# Altium schematic sheet PCB_RTM_SATA.SchDoc: RTM SATA
size 420 x 297 mm; Author: G.K.; CompanyName: WUT; DrawnBy: G.K.; Organization: CERN; Address1: Warsaw Univeristy of Technology; Address2: Nowowiejska 15/19; Revision: -; SheetNumber: -; SheetTotal: -; EDA_Number: ARTIQ; Projet: SINARA; ModifiedBy: -; CreateDate: XX/XX/XXXX; CheckedDate: -; Title2: adapter; DivGrp: ISE; Designer: G.K.; ModifiedDate: -; ProjectName: SINARA
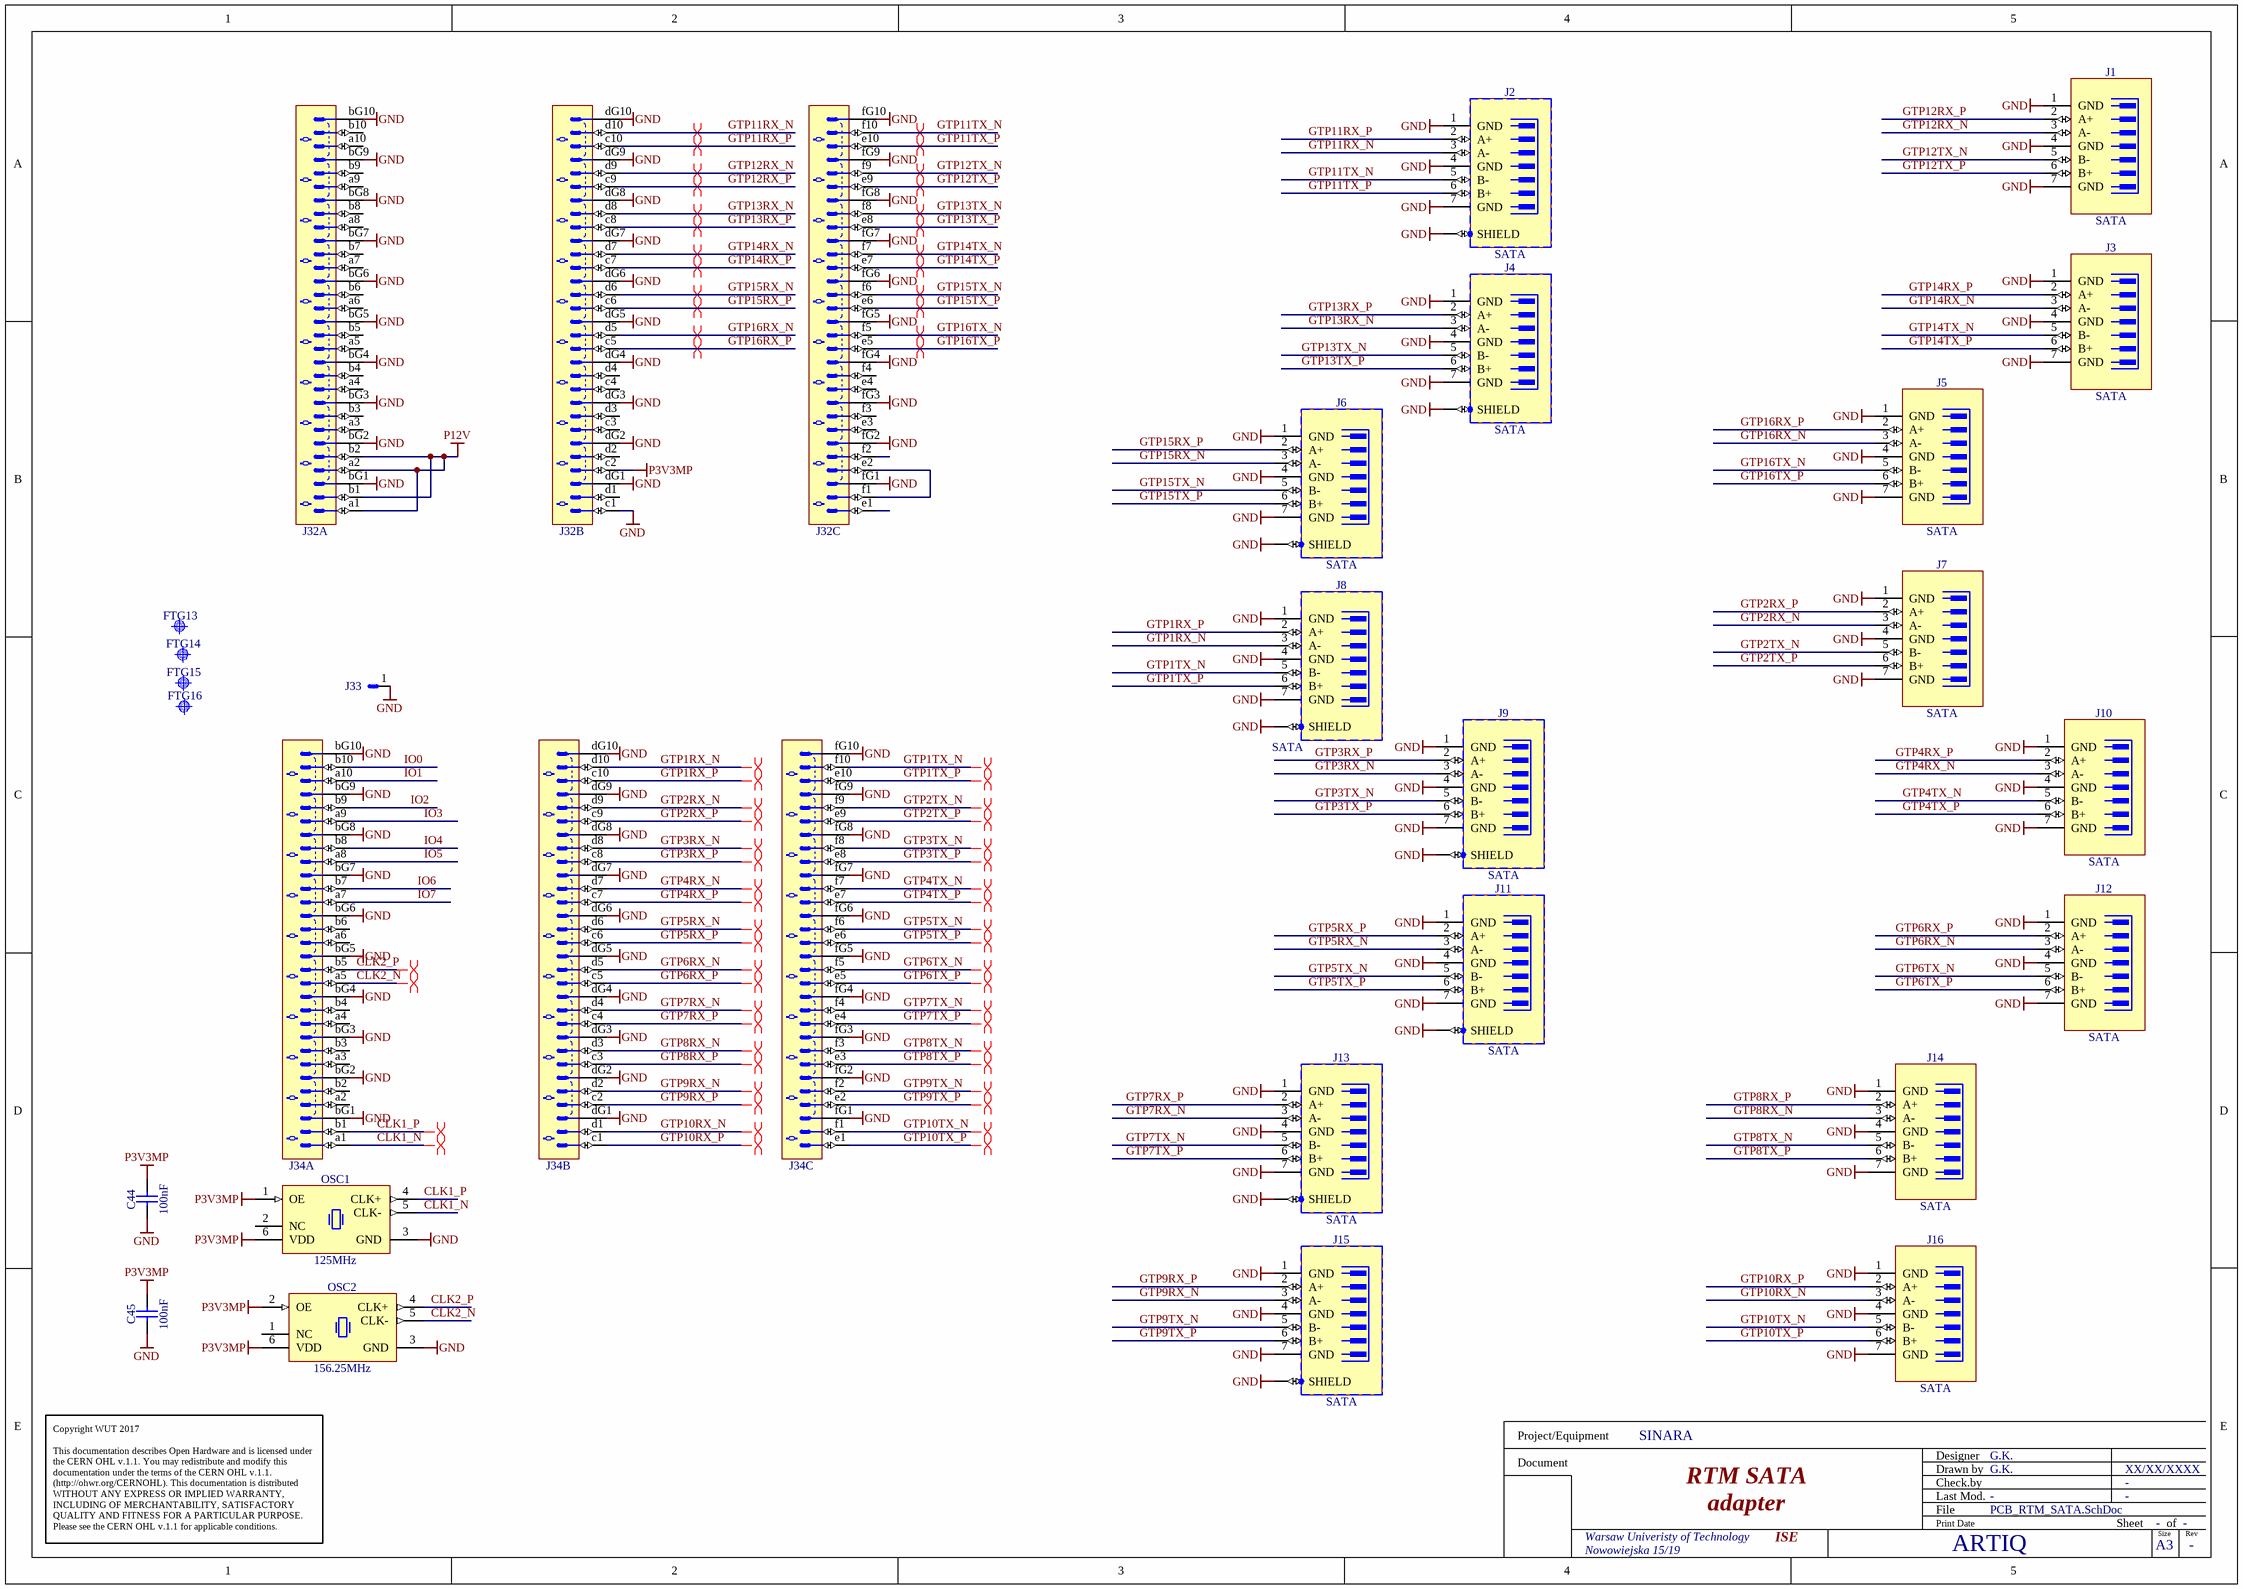
[diagram p0: PCB_RTM_SATA.SchDoc]

## Parts
C44  100nF  [CAPC1005X55N]
C45  100nF  [CAPC1005X55N]
FTG13  Use only in PCB  [FIDUCIAL_TOP_C100-200]  (value not drawn)
FTG14  Use only in PCB  [FIDUCIAL_TOP_S100-200]  (value not drawn)
FTG15  Use only in PCB  [FIDUCIAL_TOP_S200-400]  (value not drawn)
FTG16  Use only in PCB  [FIDUCIAL_TOP_S100-200]  (value not drawn)
J1  SATA  [MOLEX_67800-5005]
J2  SATA  [3M_5607-4200-SH]
J3  SATA  [MOLEX_67800-5005]
J4  SATA  [3M_5607-4200-SH]
J5  SATA  [MOLEX_67800-5005]
J6  SATA  [3M_5607-4200-SH]
J7  SATA  [MOLEX_67800-5005]
J8  SATA  [3M_5607-4200-SH]
J9  SATA  [3M_5607-4200-SH]
J10  SATA  [MOLEX_67800-5005]
J11  SATA  [3M_5607-4200-SH]
J12  SATA  [MOLEX_67800-5005]
J13  SATA  [3M_5607-4200-SH]
J14  SATA  [MOLEX_67800-5005]
J15  SATA  [3M_5607-4200-SH]
J16  SATA  [MOLEX_67800-5005]
J32  (no value)  [TYCO_6469183-1]  (parts A,B,C of 3)
J33  (no value)  [TYCO_1469265-1]
J34  (no value)  [TYCO_6469183-1]  (parts A,B,C of 3)
OSC1  125MHz  [OSC_SILICON-LAB_SI531]
OSC2  156.25MHz  [OSC_SILICON-LAB_SI530]

## Nets
GND: C44.1 C45.1 J1.1(GND) J1.4(GND) J1.7(GND) J2.1(GND) J2.4(GND) J2.7(GND) J2.8(SHIELD) J3.1(GND) J3.4(GND) J3.7(GND) J4.1(GND) J4.4(GND) J4.7(GND) J4.8(SHIELD) J5.1(GND) J5.4(GND) J5.7(GND) J6.1(GND) J6.4(GND) J6.7(GND) J6.8(SHIELD) J7.1(GND) J7.4(GND) J7.7(GND) J8.1(GND) J8.4(GND) J8.7(GND) J8.8(SHIELD) J9.1(GND) J9.4(GND) J9.7(GND) J9.8(SHIELD) J10.1(GND) J10.4(GND) J10.7(GND) J11.1(GND) J11.4(GND) J11.7(GND) J11.8(SHIELD) J12.1(GND) J12.4(GND) J12.7(GND) J13.1(GND) J13.4(GND) J13.7(GND) J13.8(SHIELD) J14.1(GND) J14.4(GND) J14.7(GND) J15.1(GND) J15.4(GND) J15.7(GND) J15.8(SHIELD) J16.1(GND) J16.4(GND) J16.7(GND) J32.bG1 J32.bG2 J32.bG3 J32.bG4 J32.bG5 J32.bG6 J32.bG7 J32.bG8 J32.bG9 J32.bG10 J32.c1 J32.dG1 J32.dG2 J32.dG3 J32.dG4 J32.dG5 J32.dG6 J32.dG7 J32.dG8 J32.dG9 J32.dG10 J32.fG1 J32.fG2 J32.fG3 J32.fG4 J32.fG5 J32.fG6 J32.fG7 J32.fG8 J32.fG9 J32.fG10 J33.1 J34.bG1 J34.bG2 J34.bG3 J34.bG4 J34.bG5 J34.bG6 J34.bG7 J34.bG8 J34.bG9 J34.bG10 J34.dG1 J34.dG2 J34.dG3 J34.dG4 J34.dG5 J34.dG6 J34.dG7 J34.dG8 J34.dG9 J34.dG10 J34.fG1 J34.fG2 J34.fG3 J34.fG4 J34.fG5 J34.fG6 J34.fG7 J34.fG8 J34.fG9 J34.fG10 OSC1.3(GND) OSC2.3(GND)
P3V3MP: C44.2 C45.2 J32.c2 OSC1.1(OE) OSC1.6(VDD) OSC2.2(OE) OSC2.6(VDD)
P12V: J32.a1 J32.a2 J32.b1 J32.b2
CLK1_N: J34.a1 OSC1.5(CLK-)
CLK1_P: J34.b1 OSC1.4(CLK+)
CLK2_N: J34.a5 OSC2.5(CLK-)
CLK2_P: J34.b5 OSC2.4(CLK+)
GTP1RX_N: J8.3(A-) J34.d10
GTP1RX_P: J8.2(A+) J34.c10
GTP1TX_N: J8.5(B-) J34.f10
GTP1TX_P: J8.6(B+) J34.e10
GTP2RX_N: J7.3(A-) J34.d9
GTP2RX_P: J7.2(A+) J34.c9
GTP2TX_N: J7.5(B-) J34.f9
GTP2TX_P: J7.6(B+) J34.e9
GTP3RX_N: J9.3(A-) J34.d8
GTP3RX_P: J9.2(A+) J34.c8
GTP3TX_N: J9.5(B-) J34.f8
GTP3TX_P: J9.6(B+) J34.e8
GTP4RX_N: J10.3(A-) J34.d7
GTP4RX_P: J10.2(A+) J34.c7
GTP4TX_N: J10.5(B-) J34.f7
GTP4TX_P: J10.6(B+) J34.e7
GTP5RX_N: J11.3(A-) J34.d6
GTP5RX_P: J11.2(A+) J34.c6
GTP5TX_N: J11.5(B-) J34.f6
GTP5TX_P: J11.6(B+) J34.e6
GTP6RX_N: J12.3(A-) J34.d5
GTP6RX_P: J12.2(A+) J34.c5
GTP6TX_N: J12.5(B-) J34.f5
GTP6TX_P: J12.6(B+) J34.e5
GTP7RX_N: J13.3(A-) J34.d4
GTP7RX_P: J13.2(A+) J34.c4
GTP7TX_N: J13.5(B-) J34.f4
GTP7TX_P: J13.6(B+) J34.e4
GTP8RX_N: J14.3(A-) J34.d3
GTP8RX_P: J14.2(A+) J34.c3
GTP8TX_N: J14.5(B-) J34.f3
GTP8TX_P: J14.6(B+) J34.e3
GTP9RX_N: J15.3(A-) J34.d2
GTP9RX_P: J15.2(A+) J34.c2
GTP9TX_N: J15.5(B-) J34.f2
GTP9TX_P: J15.6(B+) J34.e2
GTP10RX_N: J16.3(A-) J34.d1
GTP10RX_P: J16.2(A+) J34.c1
GTP10TX_N: J16.5(B-) J34.f1
GTP10TX_P: J16.6(B+) J34.e1
GTP11RX_N: J2.3(A-) J32.d10
GTP11RX_P: J2.2(A+) J32.c10
GTP11TX_N: J2.5(B-) J32.f10
GTP11TX_P: J2.6(B+) J32.e10
GTP12RX_N: J1.3(A-) J32.d9
GTP12RX_P: J1.2(A+) J32.c9
GTP12TX_N: J1.5(B-) J32.f9
GTP12TX_P: J1.6(B+) J32.e9
GTP13RX_N: J4.3(A-) J32.d8
GTP13RX_P: J4.2(A+) J32.c8
GTP13TX_N: J4.5(B-) J32.f8
GTP13TX_P: J4.6(B+) J32.e8
GTP14RX_N: J3.3(A-) J32.d7
GTP14RX_P: J3.2(A+) J32.c7
GTP14TX_N: J3.5(B-) J32.f7
GTP14TX_P: J3.6(B+) J32.e7
GTP15RX_N: J6.3(A-) J32.d6
GTP15RX_P: J6.2(A+) J32.c6
GTP15TX_N: J6.5(B-) J32.f6
GTP15TX_P: J6.6(B+) J32.e6
GTP16RX_N: J5.3(A-) J32.d5
GTP16RX_P: J5.2(A+) J32.c5
GTP16TX_N: J5.5(B-) J32.f5
GTP16TX_P: J5.6(B+) J32.e5
IO0: J34.b10
IO1: J34.a10
IO2: J34.b9
IO3: J34.a9
IO4: J34.b8
IO5: J34.a8
IO6: J34.b7
IO7: J34.a7
NetJ32_e2: J32.e2 J32.f1

Not connected (* = marked no-connect by the designer): J32 a3 a4 a5 a6 a7 a8 a9 a10 b3 b4 b5 b6 b7 b8 b9 b10 c3 c4 d1 d2 d3 d4 e1 e3 e4 f2 f3 f4; J34 a2 a3 a4 a6 b2 b3 b4 b6; OSC1 2(NC); OSC2 1(NC)

## Layout directives
differential pair: CLK1_N, CLK1_P, CLK2_N, CLK2_P, GTP1RX_N, GTP1RX_P, GTP1TX_N, GTP1TX_P, GTP2RX_N, GTP2RX_P, GTP2TX_N, GTP2TX_P, GTP3RX_N, GTP3RX_P, GTP3TX_N, GTP3TX_P, GTP4RX_N, GTP4RX_P, GTP4TX_N, GTP4TX_P, GTP5RX_N, GTP5RX_P, GTP5TX_N, GTP5TX_P, GTP6RX_N, GTP6RX_P, GTP6TX_N, GTP6TX_P, GTP7RX_N, GTP7RX_P, GTP7TX_N, GTP7TX_P, GTP8RX_N, GTP8RX_P, GTP8TX_N, GTP8TX_P, GTP9RX_N, GTP9RX_P, GTP9TX_N, GTP9TX_P, GTP10RX_N, GTP10RX_P, GTP10TX_N, GTP10TX_P, GTP11RX_N, GTP11RX_P, GTP11TX_N, GTP11TX_P, GTP12RX_N, GTP12RX_P, GTP12TX_N, GTP12TX_P, GTP13RX_N, GTP13RX_P, GTP13TX_N, GTP13TX_P, GTP14RX_N, GTP14RX_P, GTP14TX_N, GTP14TX_P, GTP15RX_N, GTP15RX_P, GTP15TX_N, GTP15TX_P, GTP16RX_N, GTP16RX_P, GTP16TX_N, GTP16TX_P

## Notes on the sheet
- Copyright WUT 2017
  This documentation describes Open Hardware and is licensed under the CERN OHL v.1.1. You may redistribute and modify this documentation under the terms of the CERN OHL v.1.1. (http://ohwr.org/CERNOHL). This documentation is distributed WITHOUT ANY EXPRESS OR IMPLIED WARRANTY, INCLUDING OF MERCHANTABILITY, SATISFACTORY QUALITY AND FITNESS FOR A PARTICULAR PURPOSE. Please see the CERN OHL v.1.1 for applicable conditions.
- Project/Equipment
- Document
- Designer
- Drawn by
- Check.by
- File
- Last Mod.
- Print Date
- Sheet
- Size
- A3
- of
- Rev

## Library data of the parts
C44 C45 = CC0402_100NF_16V_10%_X7R: Non-polarised capacitor; Part Description: SMD Multilayer Chip Ceramic Capacitor; Manufacturer: GENERIC; Manufacturer1 Part Number: GRM155R71C104KA88D; Voltage: 16V; TC: X7R; Tolerance: ±10%; Part Number: CC0402_100NF_16V_10%_X7R; Component Kind: Standard; Component Type: Standard; Pin Count: 2; Value: 100nF; Status: Not Recommended; Manufacturer Part Number: CC0402_100NF_16V_10%_X7R; Case: 0402; Mounted: Yes; Socket: No; SMD: Yes; Sense: No; Manufacturer1 Example: MURATA; Manufacturer1 ComponentHeight: 0.55mm; HelpURL: \\cern.ch\dfs\Applications\Altium\Datasheets\CC0402_X7R_MURATA_GRM.pdf; Author: CERN DEM JLC; CreateDate: 05.12.2013; LatestRevisionDate: 03.12.2007
FTG13 = FIDUCIAL_TARGET_C100-200: Fiducial Target; Part Description: Round Fiducial Target, Top Layer, 1.0mm, Top Solder 2.0mm, Keepout =2.0mm; Mounted: No; Part Number: FIDUCIAL_TARGET_C100-200; Component Kind: Standard (No BOM); Component Type: Standard (No BOM); Pin Count: 1; Family: Fiducial; Socket: No; SMD: Yes; Sense: No; Status: None; ComponentHeight: 0mm; HelpURL: Undefined; Author: CERN DEM JLC; CreateDate: 09.02.2010; LatestRevisionDate: 04.04.2012; PackageDescription: Round Fiducial Target, Top Layer, 1.0mm, Top Solder 2.0mm, Keepout =2.0mm
FTG14 FTG16 = FIDUCIAL_TARGET_S100-200: Fiducial Target; Part Description: Square Fiducial Target, Top Layer, 1.0mm, Top Solder 2.0mm, Keepout =2.0mm; Mounted: No; Part Number: FIDUCIAL_TARGET_S100-200; Component Kind: Standard (No BOM); Component Type: Standard (No BOM); Pin Count: 1; Family: Fiducial; Socket: No; SMD: Yes; Sense: No; Status: None; ComponentHeight: 0mm; HelpURL: Undefined; Author: CERN DEM JLC; CreateDate: 09.02.2010; LatestRevisionDate: 04.04.2012; PackageDescription: Square Fiducial Target, Top Layer, 1.0mm, Top Solder 2.0mm, Keepout =2.0mm
FTG15 = FIDUCIAL_TARGET_S200-400: Fiducial Target; Part Description: Square Fiducial Target, Top Layer, 2.0mm, Top Solder 4.0mm, Keepout =4.0mm; Mounted: No; Part Number: FIDUCIAL_TARGET_S200-400; Component Kind: Standard (No BOM); Component Type: Standard (No BOM); Pin Count: 1; Family: Fiducial; Socket: No; SMD: Yes; Sense: No; Status: None; ComponentHeight: 0mm; HelpURL: Undefined; Author: CERN DEM JLC; CreateDate: 02.06.2008; LatestRevisionDate: 04.04.2012; PackageDescription: Square Fiducial Target, Top Layer, 2.0mm, Top Solder 4.0mm, Keepout =4.0mm
J1 J3 J5 J7 J10 J12 J14 J16 = MOLEX_67800-5005: 7 Pin SATA Receptacle; Part Description: 1.27mm Pitch, 7 Contacts, Serial ATA High Speed Header, Straight with Locking Latch; Manufacturer: MOLEX; PressFit: No; Part Number: MOLEX_67800-5005; Component Kind: Standard; Component Type: Standard; Pin Count: 7; Family: SATA; Mounted: Yes; Socket: No; SMD: Yes; Sense: No; Status: None; Manufacturer Part Number: 67800-5005; ComponentHeight: 8.4mm; HelpURL: \\cern.ch\dfs\Applications\Altium\Datasheets\MOLEX_67800-5005.pdf; Author: CERN DEM MR; CreateDate: 01.12.2016; LatestRevisionDate: 01.12.2016
J2 J4 J6 J8 J9 J11 J13 J15 = 3M_5607-4200-SH: 7 Pin + 1 Shield SATA Receptacle; Part Description: Signal Plug, Surfacemount, Right Angle,  Serial Advanced Technology Attachment (SATA) Connector, 5607 Series; Manufacturer: 3M; PressFit: No; Part Number: 3M_5607-4200-SH; Component Kind: Standard; Component Type: Standard; Pin Count: 8; Family: SATA; Mounted: Yes; Socket: No; SMD: Yes; Sense: No; Status: None; Manufacturer Part Number: 5607-4200-SH; ComponentHeight: 4mm; HelpURL: \\cern.ch\dfs\Applications\Altium\Datasheets\3M_5607-4200-SH.pdf; Author: CERN DEM JLC; CreateDate: 14.02.2011; LatestRevisionDate: 31.05.2011
J32 J34 = TYCO_6469183-1: Connector 60 ATCA Male 30 Pairs (60 Signals) + 3x10 Ground; Part Number: TYCO_6469183-1
J33 = TYCO_1469265-1: Single Pin Male; Part Number: TYCO_1469265-1
OSC1 = OSC_125MHZ_SILICON-LAB_531BC125M000DG: 10-1400MHz, Crystal Oscillator (XO), Si531 Series; Part Description: 3.3V ±20ppm LVDS Crystal Oscillator (XO), Si531 Series; Manufacturer: SILICON LABS; PressFit: No; Bonding: No; Part Number: OSC_125MHZ_SILICON-LAB_531BC125M000DG; Component Kind: Standard; Component Type: Standard; PackageDescription: Oscillator Si531 Series, 6 pins, 5x7mm; Value: 125MHz; Manufacturer Part Number: 531BC125M000DG; Pin Count: 6; Mounted: Yes; Socket: No; SMD: Yes; Sense: No; ComponentHeight: 1.8mm; HelpURL: \\cern.ch\dfs\Applications\Altium\Datasheets\OSC_SILICON-LAB_SI531.pdf; Author: CERN DEM MR; CreateDate: 16.03.2016; LatestRevisionDate: 16.03.2016
OSC2 = OSC_156.25MHZ_SILICON-LAB_530BC156M250DG: 10-1400MHz, Crystal Oscillator (XO), Si530 Series; Part Description: 3.3V ±20ppm LVDS Crystal Oscillator (XO), Si530 Series; Manufacturer: SILICON LABS; PressFit: No; Bonding: No; Part Number: OSC_156.25MHZ_SILICON-LAB_530BC156M250DG; Component Kind: Standard; Component Type: Standard; PackageDescription: Oscillator Si530 Series, 6 pins, 5x7mm; Value: 156.25MHz; Manufacturer Part Number: 530BC156M250DG; Pin Count: 6; Mounted: Yes; Socket: No; SMD: Yes; Sense: No; ComponentHeight: 1.8mm; HelpURL: \\cern.ch\dfs\Applications\Altium\Datasheets\OSC_SILICON-LAB_SI530.pdf; Author: CERN DEM MR; CreateDate: 01.02.2016; LatestRevisionDate: 16.03.2016